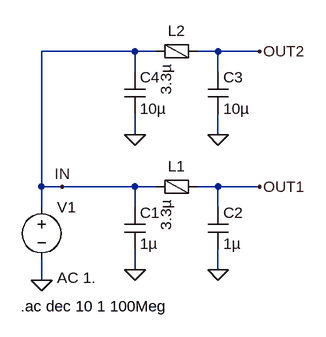
[diagram p0: schematic filter.asc]
filter.asc, the LTspice schematic file:
Version 4
SHEET 1 880 680
WIRE 112 -80 -32 -80
WIRE 144 -80 112 -80
WIRE 240 -80 208 -80
WIRE 304 -80 240 -80
WIRE 112 -48 112 -80
WIRE 240 -48 240 -80
WIRE 112 48 112 16
WIRE 240 48 240 16
WIRE -32 128 -32 -80
WIRE 0 128 -32 128
WIRE 112 128 0 128
WIRE 144 128 112 128
WIRE 240 128 208 128
WIRE 304 128 240 128
WIRE -32 160 -32 128
WIRE 112 160 112 128
WIRE 240 160 240 128
WIRE 112 256 112 224
WIRE 240 256 240 224
WIRE -32 272 -32 240
FLAG 112 256 0
FLAG 240 256 0
FLAG -32 272 0
FLAG 0 128 IN
FLAG 304 128 OUT1
FLAG 112 48 0
FLAG 240 48 0
FLAG 304 -80 OUT2
SYMBOL cap 224 160 R0
SYMATTR InstName C2
SYMATTR Value 1µ
SYMBOL cap 96 160 R0
SYMATTR InstName C1
SYMATTR Value 1µ
SYMBOL voltage -32 144 R0
WINDOW 123 24 124 Left 2
WINDOW 39 0 0 Left 0
SYMATTR Value2 AC 1.
SYMATTR InstName V1
SYMATTR Value ""
SYMBOL FerriteBead 176 128 R90
WINDOW 0 -16 0 VBottom 2
SYMATTR InstName L1
SYMATTR Value 3.3µ
SYMATTR SpiceLine Ipk=0.6 Rser=0.23 Rpar=1050 Cpar=680f mfg="Würth Elektronik" pn="742792662 WE-CBF 0603"
SYMBOL cap 224 -48 R0
SYMATTR InstName C3
SYMATTR Value 10µ
SYMBOL cap 96 -48 R0
SYMATTR InstName C4
SYMATTR Value 10µ
SYMBOL FerriteBead 176 -80 R90
WINDOW 0 -16 0 VBottom 2
SYMATTR InstName L2
SYMATTR Value 3.3µ
SYMATTR SpiceLine Ipk=0.6 Rser=0.23 Rpar=1050 Cpar=680f mfg="Würth Elektronik" pn="742792662 WE-CBF 0603"
TEXT -64 312 Left 2 !.ac dec 10 1 100Meg

The netlist it stands for:
* filter.asc
C2 OUT1 0 1µ
C1 IN 0 1µ
V1 IN 0 AC 1.
L1 OUT1 IN 3.3µ Ipk=0.6 Rser=0.23 Rpar=1050 Cpar=680f mfg="Würth Elektronik" pn="742792662 WE-CBF 0603"
C3 OUT2 0 10µ
C4 IN 0 10µ
L2 OUT2 IN 3.3µ Ipk=0.6 Rser=0.23 Rpar=1050 Cpar=680f mfg="Würth Elektronik" pn="742792662 WE-CBF 0603"
.ac dec 10 1 100Meg
.backanno
.end